# Altium schematic sheet Sch.SchDoc
size A2
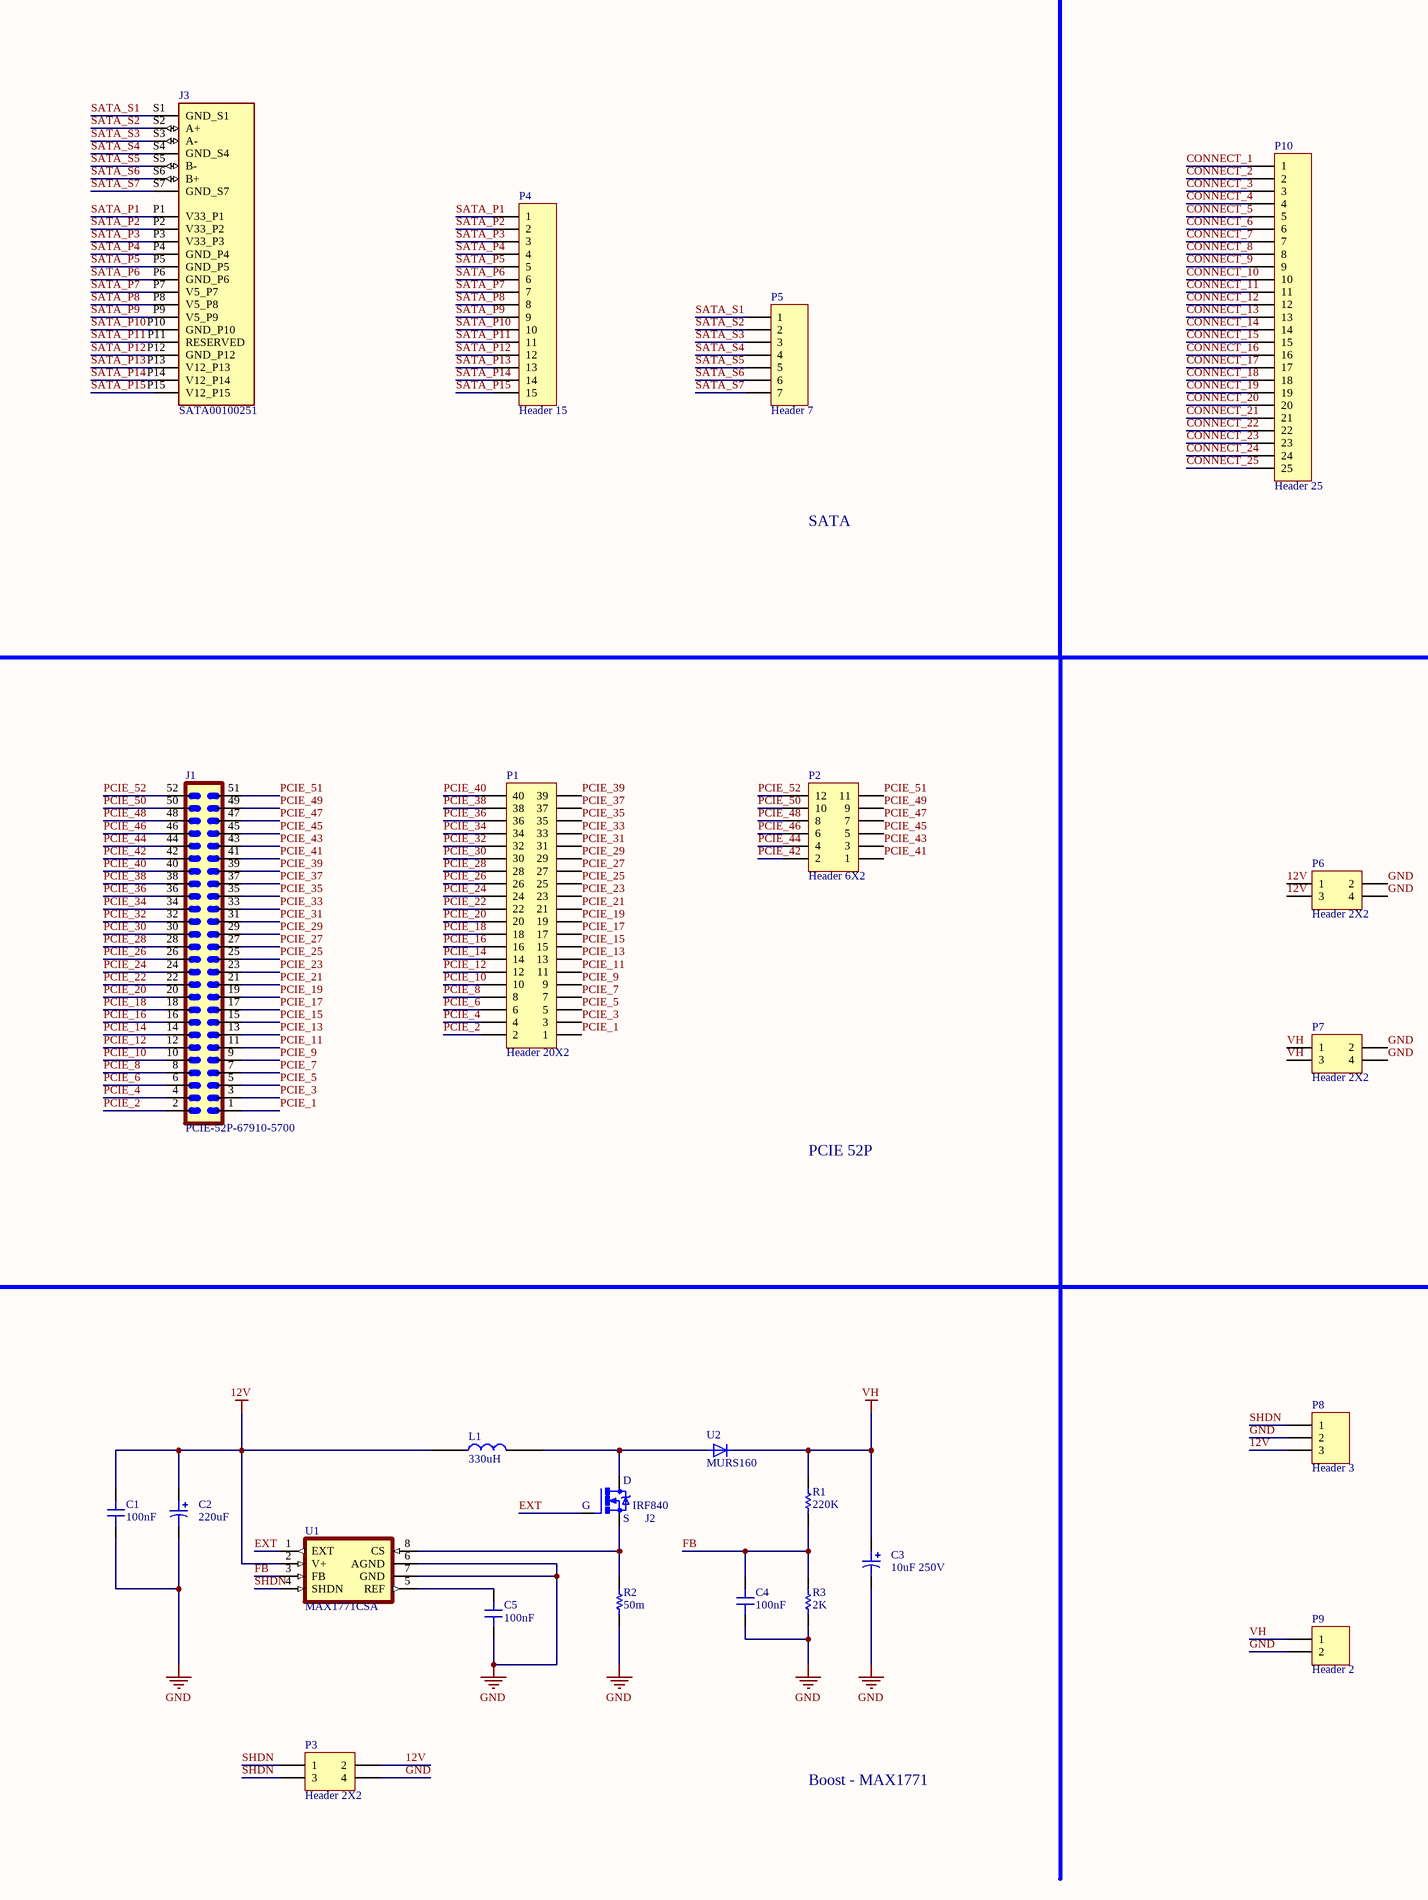
[diagram p0: Sch.SchDoc, left]
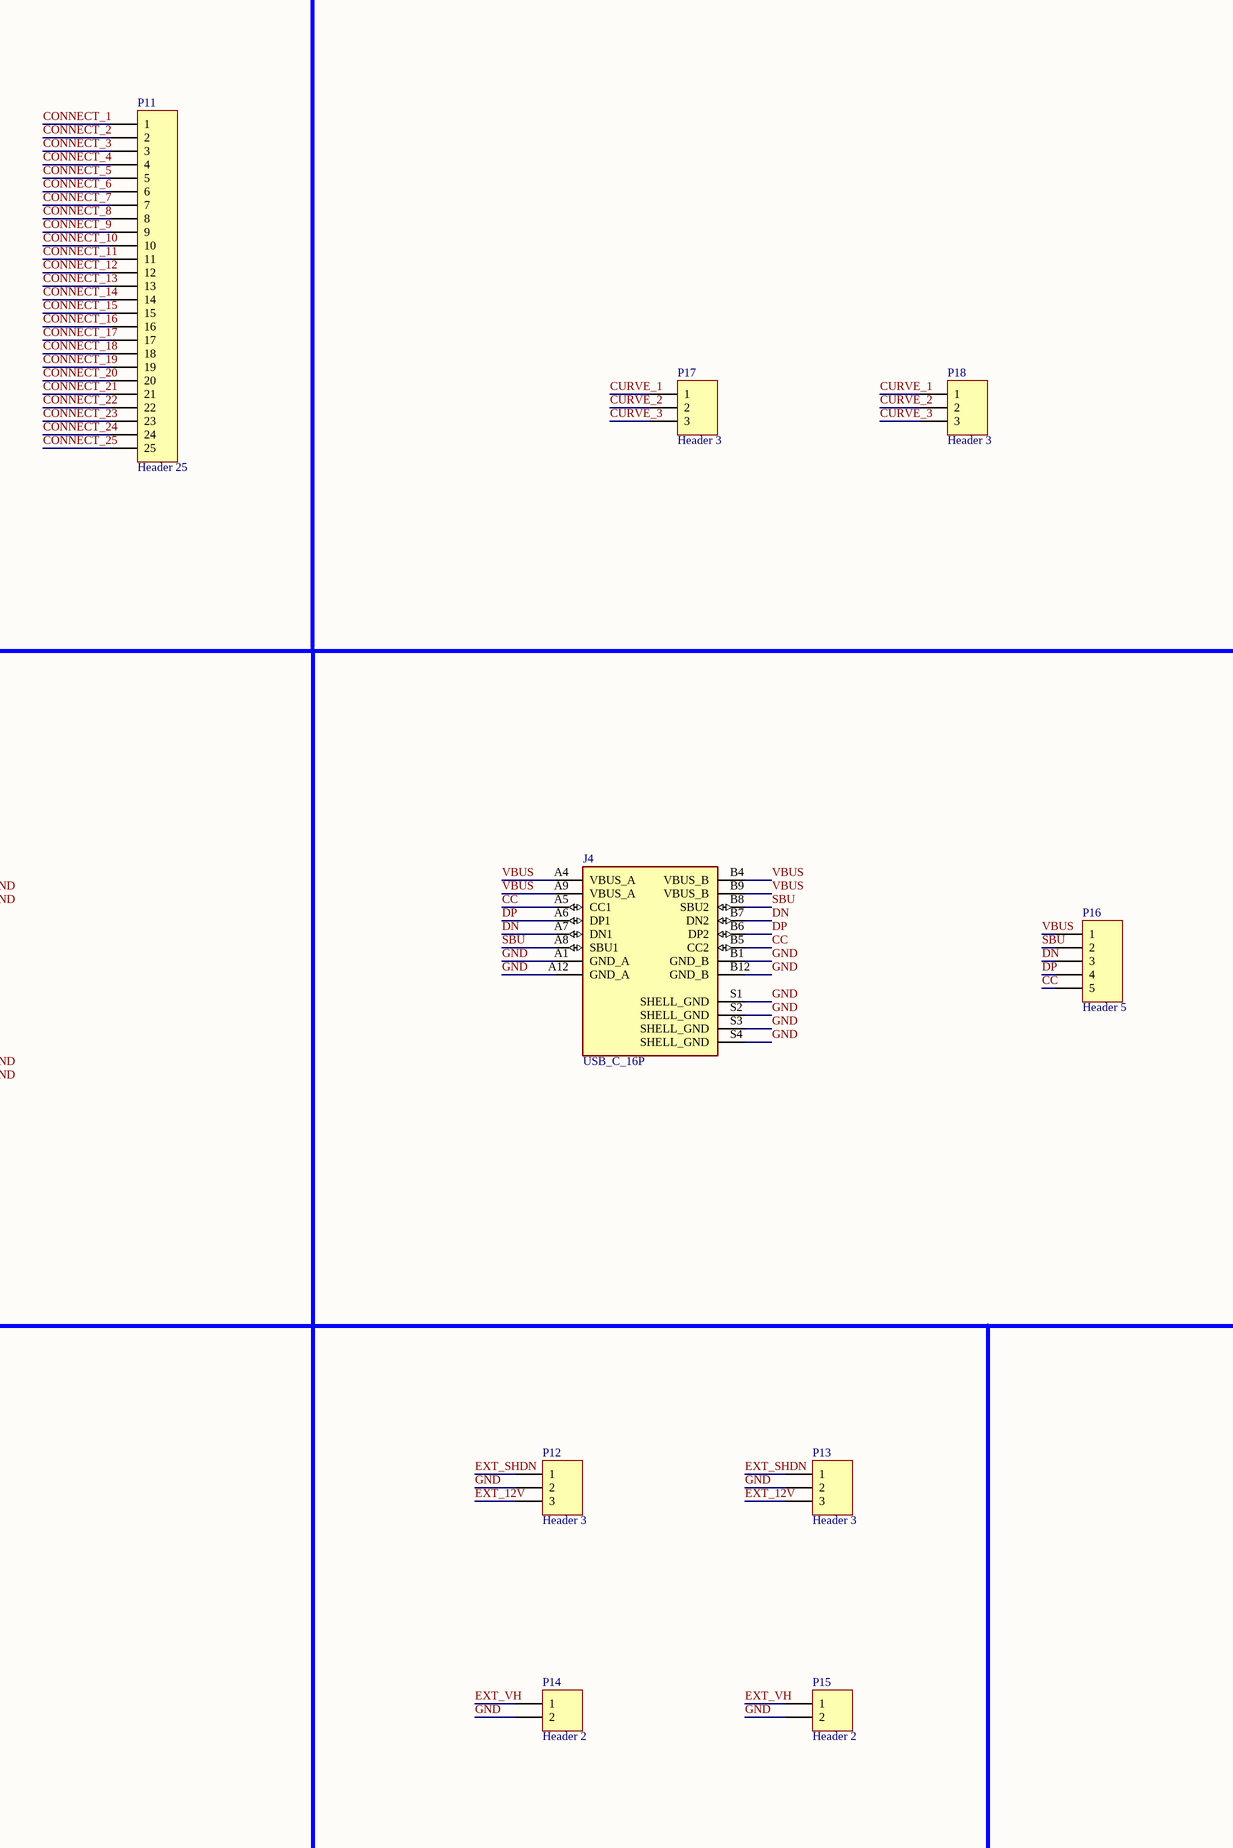
[diagram p1: Sch.SchDoc, right]

## Parts
C1  100nF  [0805]
C2  220uF  [CAPAE7666X77M_6-3x7-7]
C3  10uF 250V  [CAPAE113103X125M_10x12-5]
C4  100nF  [0805]
C5  100nF  [0805]
J1  PCIE-52P-67910-5700  [PCIE-52P-67910-5700]
J2  IRF840  [TO220V]
J3  SATA00100251  [AMPHENOL_SATA00100251]
J4  USB_C_16P  [USB_C_16P_CSP-USC16-TR]
L1  330uH  [INDP125125X80N]
P1  Header 20X2  [HDR2X20]
P2  Header 6X2  [HDR2X6]
P3  Header 2X2  [HDR2X2]
P4  Header 15  [HDR1X15]
P5  Header 7  [HDR1X7]
P6  Header 2X2  [HDR2X2]
P7  Header 2X2  [HDR2X2]
P8  Header 3  [HDR1X3]
P9  Header 2  [HDR1X2]
P10  Header 25  [HDR1X25]
P11  Header 25  [HDR1X25]
P12  Header 3  [HDR1X3]
P13  Header 3  [HDR1X3]
P14  Header 2  [HDR1X2]
P15  Header 2  [HDR1X2]
P16  Header 5  [HDR1X5]
P17  Header 3  [HDR1X3]
P18  Header 3  [HDR1X3]
R1  220K  [0805]
R2  50m  [0805]
R3  2K  [0805]
U1  MAX1771CSA  [MAX1771CSA]
U2  MURS160  [MURS160]

## Nets
12V: C1.1 C2.1 L1.1 P3.2 P6.1 P6.3 P8.3 U1.2(V+)
GND: C1.2 C2.2 C3.2 C4.2 C5.2 J4.A1(GND_A) J4.A12(GND_A) J4.B1(GND_B) J4.B12(GND_B) J4.S1(SHELL_GND) J4.S2(SHELL_GND) J4.S3(SHELL_GND) J4.S4(SHELL_GND) P3.4 P6.2 P6.4 P7.2 P7.4 P8.2 P9.2 P12.2 P13.2 P14.2 P15.2 R2.2 R3.2 U1.6(AGND) U1.7(GND)
VH: C3.1 P7.1 P7.3 P9.1 R1.1 U2.2(C)
CC: J4.A5(CC1) J4.B5(CC2) P16.5
CONNECT_1: P10.1 P11.1
CONNECT_2: P10.2 P11.2
CONNECT_3: P10.3 P11.3
CONNECT_4: P10.4 P11.4
CONNECT_5: P10.5 P11.5
CONNECT_6: P10.6 P11.6
CONNECT_7: P10.7 P11.7
CONNECT_8: P10.8 P11.8
CONNECT_9: P10.9 P11.9
CONNECT_10: P10.10 P11.10
CONNECT_11: P10.11 P11.11
CONNECT_12: P10.12 P11.12
CONNECT_13: P10.13 P11.13
CONNECT_14: P10.14 P11.14
CONNECT_15: P10.15 P11.15
CONNECT_16: P10.16 P11.16
CONNECT_17: P10.17 P11.17
CONNECT_18: P10.18 P11.18
CONNECT_19: P10.19 P11.19
CONNECT_20: P10.20 P11.20
CONNECT_21: P10.21 P11.21
CONNECT_22: P10.22 P11.22
CONNECT_23: P10.23 P11.23
CONNECT_24: P10.24 P11.24
CONNECT_25: P10.25 P11.25
CURVE_1: P17.1 P18.1
CURVE_2: P17.2 P18.2
CURVE_3: P17.3 P18.3
DN: J4.A7(DN1) J4.B7(DN2) P16.3
DP: J4.A6(DP1) J4.B6(DP2) P16.4
EXT: J2.1(G) U1.1(EXT)
EXT_12V: P12.3 P13.3
EXT_SHDN: P12.1 P13.1
EXT_VH: P14.1 P15.1
FB: C4.1 R1.2 R3.1 U1.3(FB)
PCIE_1: J1.1 P1.1
PCIE_2: J1.2 P1.2
PCIE_3: J1.3 P1.3
PCIE_4: J1.4 P1.4
PCIE_5: J1.5 P1.5
PCIE_6: J1.6 P1.6
PCIE_7: J1.7 P1.7
PCIE_8: J1.8 P1.8
PCIE_9: J1.9 P1.9
PCIE_10: J1.10 P1.10
PCIE_11: J1.11 P1.11
PCIE_12: J1.12 P1.12
PCIE_13: J1.13 P1.13
PCIE_14: J1.14 P1.14
PCIE_15: J1.15 P1.15
PCIE_16: J1.16 P1.16
PCIE_17: J1.17 P1.17
PCIE_18: J1.18 P1.18
PCIE_19: J1.19 P1.19
PCIE_20: J1.20 P1.20
PCIE_21: J1.21 P1.21
PCIE_22: J1.22 P1.22
PCIE_23: J1.23 P1.23
PCIE_24: J1.24 P1.24
PCIE_25: J1.25 P1.25
PCIE_26: J1.26 P1.26
PCIE_27: J1.27 P1.27
PCIE_28: J1.28 P1.28
PCIE_29: J1.29 P1.29
PCIE_30: J1.30 P1.30
PCIE_31: J1.31 P1.31
PCIE_32: J1.32 P1.32
PCIE_33: J1.33 P1.33
PCIE_34: J1.34 P1.34
PCIE_35: J1.35 P1.35
PCIE_36: J1.36 P1.36
PCIE_37: J1.37 P1.37
PCIE_38: J1.38 P1.38
PCIE_39: J1.39 P1.39
PCIE_40: J1.40 P1.40
PCIE_41: J1.41 P2.1
PCIE_42: J1.42 P2.2
PCIE_43: J1.43 P2.3
PCIE_44: J1.44 P2.4
PCIE_45: J1.45 P2.5
PCIE_46: J1.46 P2.6
PCIE_47: J1.47 P2.7
PCIE_48: J1.48 P2.8
PCIE_49: J1.49 P2.9
PCIE_50: J1.50 P2.10
PCIE_51: J1.51 P2.11
PCIE_52: J1.52 P2.12
SATA_P1: J3.P1(V33_P1) P4.1
SATA_P2: J3.P2(V33_P2) P4.2
SATA_P3: J3.P3(V33_P3) P4.3
SATA_P4: J3.P4(GND_P4) P4.4
SATA_P5: J3.P5(GND_P5) P4.5
SATA_P6: J3.P6(GND_P6) P4.6
SATA_P7: J3.P7(V5_P7) P4.7
SATA_P8: J3.P8(V5_P8) P4.8
SATA_P9: J3.P9(V5_P9) P4.9
SATA_P10: J3.P10(GND_P10) P4.10
SATA_P11: J3.P11(RESERVED) P4.11
SATA_P12: J3.P12(GND_P12) P4.12
SATA_P13: J3.P13(V12_P13) P4.13
SATA_P14: J3.P14(V12_P14) P4.14
SATA_P15: J3.P15(V12_P15) P4.15
SATA_S1: J3.S1(GND_S1) P5.1
SATA_S2: J3.S2(A+) P5.2
SATA_S3: J3.S3(A-) P5.3
SATA_S4: J3.S4(GND_S4) P5.4
SATA_S5: J3.S5(B-) P5.5
SATA_S6: J3.S6(B+) P5.6
SATA_S7: J3.S7(GND_S7) P5.7
SBU: J4.A8(SBU1) J4.B8(SBU2) P16.2
SHDN: P3.1 P3.3 P8.1 U1.4(SHDN)
VBUS: J4.A4(VBUS_A) J4.A9(VBUS_A) J4.B4(VBUS_B) J4.B9(VBUS_B) P16.1
NetC5_1: C5.1 U1.5(REF)
NetJ2_2: J2.2(D) L1.2 U2.1(A)
NetJ2_3: J2.3(S) R2.1 U1.8(CS)

## Notes on the sheet
- SATA
- PCIE 52P
- Boost - MAX1771

## Library data of the parts
C1 C4 C5 = Capacitor
C2 C3 = CapacitorPolarized
J1 = PCIE-52P-67910-5700: Conn Mini PCI Express Card Edge F 52 POS 0.8mm Solder RA SMD Mini PCI Express Embossed T/R; Availability: Unavailable; Package: None; MP: 67910-5700; Value: *; Price: None
J2 = IRF840: N-Channel 500 V 8A (Tc) 3.1W (Tc) Through Hole TO-220FP; MF: STMicroelectronics; MP: IRF630; Check_prices: https://www.snapeda.com/parts/IRF630/STMicroelectronics/view-part/?ref=eda; Purchase-URL: https://pricing.snapeda.com/search/part/IRF630/?ref=eda; Price: None; SnapEDA_Link: https://www.snapeda.com/parts/IRF630/STMicroelectronics/view-part/?ref=snap; Availability: In Stock; Package: TO-220 Vishay; Value: *
J3 = SATA00100251: I/O Connectors SATA RA PLUG; MF: Amphenol FCI; Value: *; Price: None; MP: SATA00100251; SnapEDA_Link: https://www.snapeda.com/parts/SATA00100251/Amphenol/view-part/?ref=snap; Check_prices: https://www.snapeda.com/parts/SATA00100251/Amphenol/view-part/?ref=eda; Purchase-URL: https://pricing.snapeda.com/search/part/SATA00100251/?ref=eda; Package: None; Availability: In Stock
J4 = USB_C_16P: CSP-USC16-TR Valcon USB Type C Surface Mount PCB Socket; SnapEDA_Link: https://www.snapeda.com/parts/CSP-USC16-TR/Valcon/view-part/?ref=snap; MF: Valcon; MP: CSP-USC16-TR; Availability: In Stock; Price: None; Value: *; Check_prices: https://www.snapeda.com/parts/CSP-USC16-TR/Valcon/view-part/?ref=eda; Package: None; Purchase-URL: https://pricing.snapeda.com/search/part/CSP-USC16-TR/?ref=eda
L1 = Inductor
P1 = Header 20X2: Header, 20-Pin, Dual row; LatestRevisionDate: 17-Jul-2002; LatestRevisionNote: Re-released for DXP Platform.; Publisher: Altium Limited
P2 = Header 6X2: Header, 6-Pin, Dual row; LatestRevisionDate: 17-Jul-2002; LatestRevisionNote: Re-released for DXP Platform.; Publisher: Altium Limited
P3 P6 P7 = Header 2X2: Header, 2-Pin, Dual row; LatestRevisionDate: 17-Jul-2002; LatestRevisionNote: Re-released for DXP Platform.; Publisher: Altium Limited
P4 = Header 15: Header, 15-Pin; LatestRevisionDate: 17-Jul-2002; LatestRevisionNote: Re-released for DXP Platform.; Publisher: Altium Limited
P5 = Header 7: Header, 7-Pin; LatestRevisionDate: 17-Jul-2002; LatestRevisionNote: Re-released for DXP Platform.; Publisher: Altium Limited
P8 P12 P13 P17 P18 = Header 3: Header, 3-Pin; LatestRevisionDate: 17-Jul-2002; LatestRevisionNote: Re-released for DXP Platform.; Publisher: Altium Limited
P9 P14 P15 = Header 2: Header, 2-Pin; LatestRevisionDate: 17-Jul-2002; LatestRevisionNote: Re-released for DXP Platform.; Publisher: Altium Limited
P10 P11 = Header 25: Header, 25-Pin; LatestRevisionDate: 17-Jul-2002; LatestRevisionNote: Re-released for DXP Platform.; Publisher: Altium Limited
P16 = Header 5: Header, 5-Pin; LatestRevisionDate: 17-Jul-2002; LatestRevisionNote: Re-released for DXP Platform.; Publisher: Altium Limited
R1-R3 = Resistor
U1 = MAX1771CSA: Boost, Buck-Boost Regulator Positive Output Step-Up, Step-Up/Step-Down - DC-DC Controller IC 8-SOIC; MF: Maxim Integrated; Price: None; MP: MAX1771CSA; Purchase-URL: https://pricing.snapeda.com/search/part/MAX1771CSA/?ref=eda; Package: SOIC-8 Maxim; Check_prices: https://www.snapeda.com/parts/MAX1771CSA/Maxim+Integrated/view-part/?ref=eda; SnapEDA_Link: https://www.snapeda.com/parts/MAX1771CSA/Maxim+Integrated/view-part/?ref=snap; Availability: In Stock; Value: *
U2 = MURS160: Diode Standard 600V 1A Surface Mount SMB; MF: World Products; MP: MURS160; Availability: Unavailable; SnapEDA_Link: https://www.snapeda.com/parts/MURS160/World%20Products/view-part/564901/?ref=snap; Package: DO-214AA-214 World Products; Price: None; Value: *